# Altium project LM317T.PrjPcb
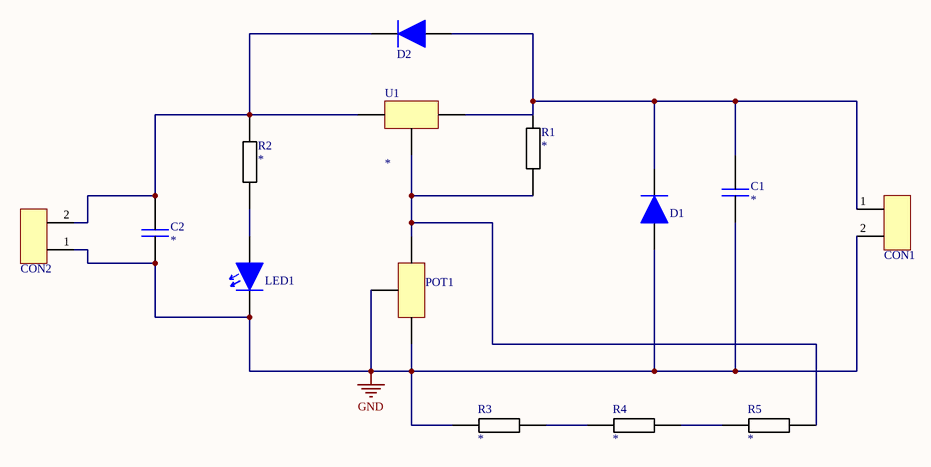
[diagram p0: LM317T_sema.SchDoc]
1 sheet, 14 parts. Net scope: global (net labels, ports and power ports of the same name join across sheets).
Board file: LM317T_PCB.PcbDoc

## Sheet LM317T_sema.SchDoc
size A4; SheetNumber: 1; SheetTotal: 1

### Parts
C1  Film  [CAP_Film]  (value not drawn)
C2  Film  [CAP_Film]  (value not drawn)
CON1  CONNECTOR*2  [CONNECTOR*2]  (value not drawn)
CON2  CONNECTOR*2  [CONNECTOR*2]  (value not drawn)
D1  1N4001  [1N4001 Diyot]  (value not drawn)
D2  1N4001  [1N4001 Diyot]  (value not drawn)
LED1  LED  [LED]  (value not drawn)
POT1  POT  [POT]  (value not drawn)
R1  RES_1/4W  [RES_1/4W]  (value not drawn)
R2  RES_1/4W  [RES_1/4W]  (value not drawn)
R3  RES_1/4W  [RES_1/4W]  (value not drawn)
R4  RES_1/4W  [RES_1/4W]  (value not drawn)
R5  RES_1/4W  [RES_1/4W]  (value not drawn)
U1  TO-220  [TO-220]  (value not drawn)

### Nets
GND: C1.1 C2.1 CON1.2 CON2.1 D1.2 LED1.2 POT1.1 POT1.2 R3.1
NetC1_2: C1.2 CON1.1 D1.1 D2.2 R1.2 U1.2
NetC2_2: C2.2 CON2.2 D2.1 R2.2 U1.3
NetLED1_1: LED1.1 R2.1
NetPOT1_3: POT1.3 R1.1 R5.2 U1.1
NetR3_2: R3.2 R4.1
NetR4_2: R4.2 R5.1

### Library data of the parts
C1 C2 = CAP_Film: Manufacturer: Nichicon; Manufacturer Part Number: UCY2G150MPD; Dielectric Material: Aluminium; Polarity: Polarized; Tolerance  (fill in as +-): 20%; Rated DC Voltage (URdc): 400V; Ripple Current: 180mA; Supplier: Mouser; Supplier Part Number: 647-UCY2G150MPD; RoHS: Yes; Category: Aluminum Electrolytic Capacitors; Stock: 1314; Pricing: 1=1,25, 10=0,861, 50=0,861, 100=0,632, 1000=0,491, 10000=0,425 (USD); Pins: 2; Terminal Finish: Copper; Min Operating Temperature: -40°C; Max Operating Temperature: 105°C; Capacitor Type: Aluminium; Package Style: RadialMeter; Packaging: Bulk; Tolerance (fill in as +-): 20%; JESD-609 Code: e3; Diameter: 10mm; Length: 20mm; Terminal Pitch: 5mm; Reach SVHC Compliant: No; RoHS Compliant: Yes; ComponentLink1URL: https://datasheet.ciiva.com:443/pdfs/VipMasterIC/IC/NICH/NICH-S-A0003527728/NICH-S-A0003527728-1.pdf?src-supplier=IHS+Markit; ComponentLink1Description: https://datasheet.ciiva.com:443/pdfs/VipMasterIC/IC/NICH/NICH-S-A0003527728/NICH-S-A0003527728-1.pdf?src-supplier=IHS+Markit; ComponentLink2URL: https://datasheet.ciiva.com/114/e-cy-114566.pdf?src-supplier=Digikey; ComponentLink2Description: https://datasheet.ciiva.com/114/e-cy-114566.pdf?src-supplier=Digikey; ComponentLink3URL: https://datasheet.ciiva.com/11686/e-cy-11686537.pdf?src-supplier=Avnet; ComponentLink3Description: https://datasheet.ciiva.com/11686/e-cy-11686537.pdf?src-supplier=Avnet; ComponentLink4URL: https://datasheet.ciiva.com/5329/e-cy-8386-5329868.pdf?src-supplier=Mouser; ComponentLink4Description: https://datasheet.ciiva.com/5329/e-cy-8386-5329868.pdf?src-supplier=Mouser; Value: *
D1 D2 = 1N4001 Diyot: Value: *
R1-R5 = RES_1/4W: Value: *
U1 = TO-220: Name: *